# EAGLE design navilock-gps-to-bluetooth-converter-v1.2-single-ic (EAGLE 8.2.2)
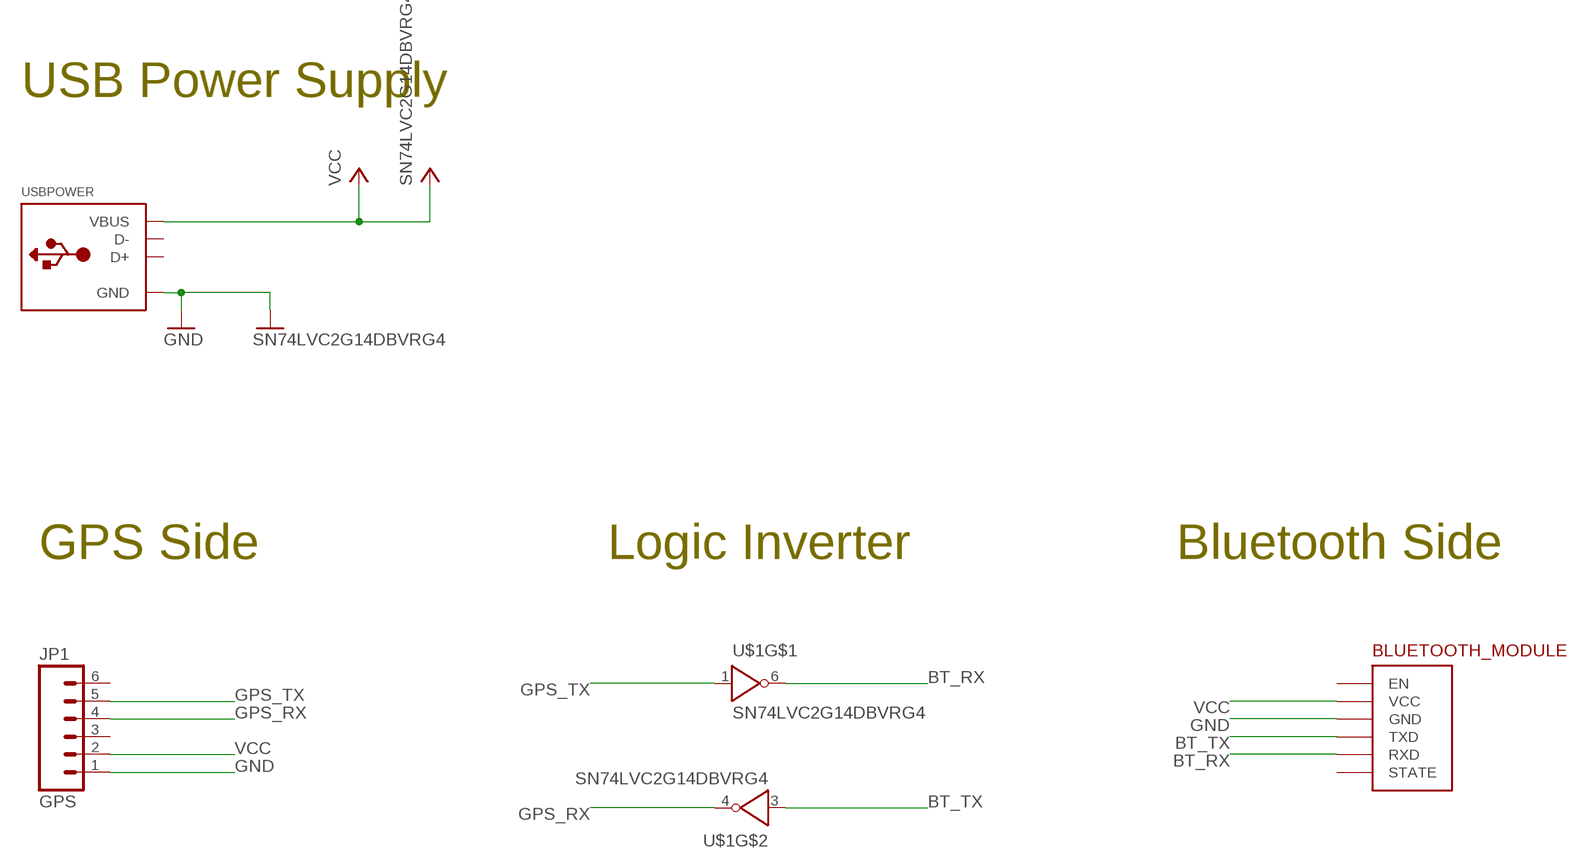
[diagram p0: schematic, sheet 1]

## Parts
BLUETOOTH_MODULE  JY-MCU-BLUETOOTHHORIZONTAL  [JY-MCU-BLUETOOTH-HORIZONTAL]
JP1  GPS  MINI-DIN6WITH-LAT-HOLES  [MINI-DIN6-WITH-LAT-HOLES]
U$1  SN74LVC2G14DBVRG4  [SOT23-6]
USBPOWER  USB_TYPEA  [USB_A-SMT]

## Nets
BT_RX: BLUETOOTH_MODULE.RXD U$1.6(O)
BT_TX: BLUETOOTH_MODULE.TXD U$1.3(I)
GND: BLUETOOTH_MODULE.GND JP1.1 U$1.2(GND:GND) USBPOWER.GND
GPS_RX: JP1.4 U$1.4(O)
GPS_TX: JP1.5 U$1.1(I)
VCC: BLUETOOTH_MODULE.VCC JP1.2 U$1.5(VCC:VCC) USBPOWER.VBUS
Unconnected: BLUETOOTH_MODULE.EN BLUETOOTH_MODULE.STATE JP1.3 JP1.6 USBPOWER.D+ USBPOWER.D-

## Notes on the sheet
- USB Power Supply
- GPS Side | Logic Inverter | Bluetooth Side

## Library data of the parts
BLUETOOTH_MODULE = kalanda:JY-MCU-BLUETOOTH
JP1 = kalanda:MINI-DIN6
U$1 = kalanda:SN74LVC2G14DBVRG4: Dual Schmitt-Trigger Inverter
USBPOWER = microbuilder:USB_TYPEA: USB - Type A Connectors Male types stick out and are inserted into a PC or matching females parts (these are the connectors used on USB Memory Sticks, etc.). Female parts are generally used for USB Host and accept a male-type connector. SMT Male - 4UCON: 10017 PTH Female - Digikey: 609-1045-ND, 4UCon: 05241

## Net classes
1 power: width 0.254 mm

## Board
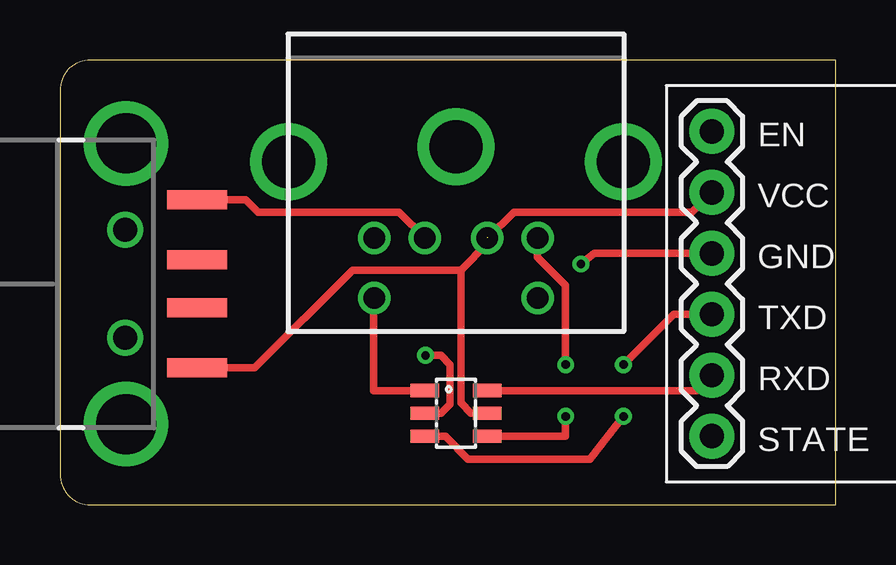
[diagram p1: board, top side]
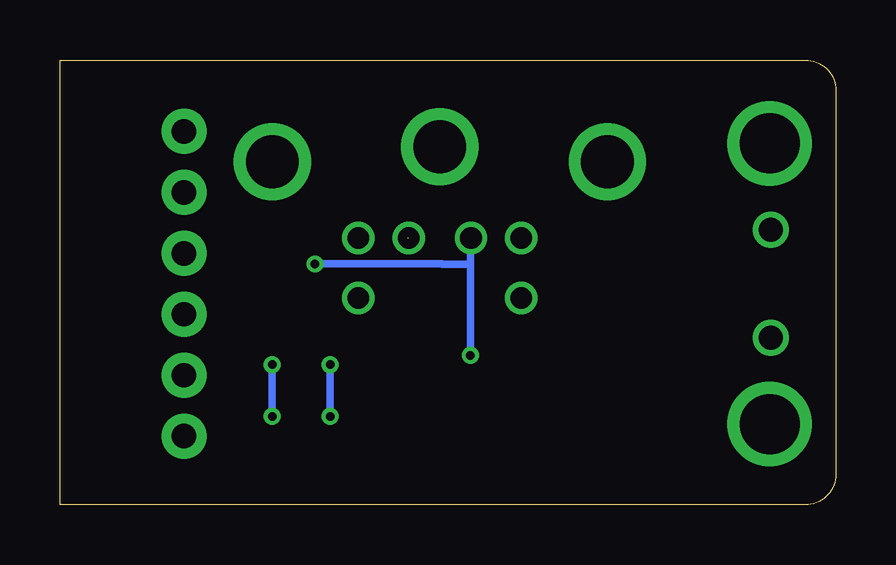
[diagram p2: board, bottom side, seen from below]

Size 32.35 x 18.53 mm. Coordinates in mm from the lower left corner, seen from the top.
Outline: 0,17.26 0,1.27 arc90 1.27,0 32.35,0 32.35,18.53 1.27,18.53 arc90 0,17.26
Copper layers (1*16): Top 0.0356mm / dielectric 1.5011mm / Bottom 0.0356mm
Design rules "LaenPCBOrder_without_tentedvias": minimum track width 6mil, minimum drill 13mil, track to track 6mil, track to pad 6mil, pad to pad 6mil, via to via 6mil, smd to smd 6mil, copper to edge 15mil, drill to drill 6mil, minimum pad ring 7mil, minimum via ring 7mil, stop-mask expansion 3mil, vias tented up to drill 30mil, thermal gap 10mil

### Footprints (pad centres in the part's own frame; a part is rotated, then mirrored left to right if it is on the bottom)
JY-MCU-BLUETOOTH-HORIZONTAL = drill 1.016 pad 1.88: EN 0,0; GND 5.08,0; RXD 10.16,0; STATE 12.7,0; TXD 7.62,0; VCC 2.54,0
MINI-DIN6-WITH-LAT-HOLES = drill 0.9: 1 -1.3,-3.42; 2 1.3,-3.42; 3 -3.4,-3.42; 4 3.4,-3.42; 5 -3.4,-5.92; 6 3.4,-5.92 | drill 2.2: P$1 0,0.38; P$2 -6.985,-0.255; P$3 6.985,-0.255
SOT23-6 = smd 0.55 x 1.2: 1 -0.95,-1.3; 2 0,-1.3; 3 0.95,-1.3; 4 0.95,1.3; 5 0,1.3; 6 -0.95,1.3
USB_A-SMT = drill 2.5 pad 3.302: D1 -5.85,2.958; D2 5.85,2.958 | drill 1: D3 -2.25,3; D4 2.25,3 | smd 0.8 x 2.5: D+ 1,0; D- -1,0; GND 3.5,0; VBUS -3.5,0

### Placement (x,y rotation side)
BLUETOOTH_MODULE  27.18,15.56 270 top
JP1  16.51,14.54 0 top
U$1  16.51,3.81 270 top
USBPOWER  5.71,9.21 90 top

### Tracks (layer width: path | path; a pad name or v marks a point on that pad's centre or on a via)
BT_RX
  Top 0.305: U$1.6 26.54,4.76 BLUETOOTH_MODULE.RXD
BT_TX  (via drill 0.35)
  Top 0.305: v23.5,3.68 22.1,1.91 17.02,1.91 16.06,2.86 U$1.3 | v23.5,5.84 25.59,7.94 BLUETOOTH_MODULE.TXD
  Bottom 0.305: v23.5,5.84 v23.5,3.68
GND  (via drill 0.35)
  Top 0.305: JP1.1 14.14,12.19 8.26,12.19 7.75,12.7 5.72,12.7 USBPOWER.GND | BLUETOOTH_MODULE.GND 22.29,10.48 v21.72,10.03 | U$1.2 15.88,3.81 16.26,4.19 16.26,5.84 15.88,6.22 v15.24,6.22
  Bottom 0.305: v21.72,10.03 16.43,10.03 16.42,10.03 15.22,10.03 | 15.22,10.03 v15.24,6.22 | 15.22,10.03 JP1.1
GPS_RX  (via drill 0.35)
  Top 0.305: U$1.4 21.08,2.86 v21.08,3.68 | v21.08,5.84 21.08,9.14 19.91,10.32 JP1.4
  Bottom 0.305: v21.08,3.68 v21.08,5.84
GPS_TX
  Top 0.305: U$1.1 13.08,4.76 13.08,8.59 JP1.5
VCC  (1 unrouted)
  Top 0.305: U$1.5 17.14,3.81 16.71,4.24 16.71,8.32 16.72,8.56 16.72,9.78 | BLUETOOTH_MODULE.VCC 26.35,12.19 18.92,12.19 17.85,11.12 17.85,10.91 16.72,9.78 | USBPOWER.VBUS 8.12,5.71 12.19,9.78 16.72,9.78